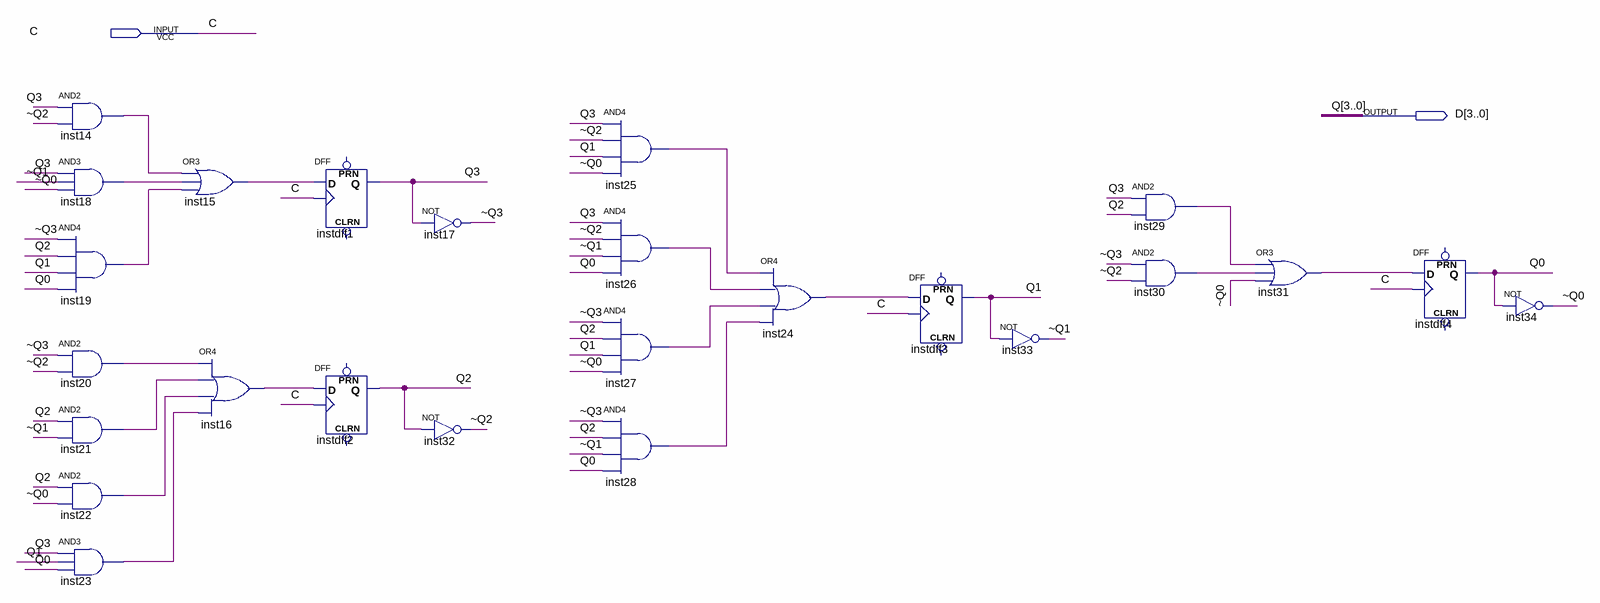
[diagram p0: schematic sheet]
// Quartus schematic Lab7_3.bdf as structural Verilog: 25 symbols, 2 pins
module Lab7_3 (
  input  C,
  output [3:0] D
);

  wire inst14_out, inst15_out, inst16_out, inst18_out, inst19_out, inst20_out, inst21_out, inst22_out,
       inst23_out, inst24_out, inst25_out, inst26_out, inst27_out, inst28_out, inst29_out, inst30_out,
       inst31_out, \~Q0 , \~Q1 , \~Q2 , \~Q3 ;

  and inst14 (inst14_out, D[3], \~Q2 );
  and inst18 (inst18_out, D[3], \~Q1 , \~Q0 );
  and inst19 (inst19_out, \~Q3 , D[2], D[1], D[0]);
  and inst20 (inst20_out, \~Q3 , \~Q2 );
  and inst21 (inst21_out, D[2], \~Q1 );
  and inst22 (inst22_out, D[2], \~Q0 );
  and inst23 (inst23_out, D[3], D[1], D[0]);
  or inst15 (inst15_out, inst14_out, inst18_out, inst19_out);
  or inst16 (inst16_out, inst20_out, inst21_out, inst22_out, inst23_out);
  DFF instdff1 (.CLK(C), .D(inst15_out), .Q(D[3]));  // open: CLRN, PRN
  DFF instdff2 (.CLK(C), .D(inst16_out), .Q(D[2]));  // open: CLRN, PRN
  not inst17 (\~Q3 , D[3]);
  not inst32 (\~Q2 , D[2]);
  and inst25 (inst25_out, D[3], \~Q2 , D[1], \~Q0 );
  and inst26 (inst26_out, D[3], \~Q2 , \~Q1 , D[0]);
  and inst27 (inst27_out, \~Q3 , D[2], D[1], \~Q0 );
  and inst28 (inst28_out, \~Q3 , D[2], \~Q1 , D[0]);
  or inst24 (inst24_out, inst25_out, inst26_out, inst27_out, inst28_out);
  DFF instdff3 (.CLK(C), .D(inst24_out), .Q(D[1]));  // open: CLRN, PRN
  not inst33 (\~Q1 , D[1]);
  and inst29 (inst29_out, D[3], D[2]);
  and inst30 (inst30_out, \~Q3 , \~Q2 );
  or inst31 (inst31_out, inst29_out, inst30_out, \~Q0 );
  DFF instdff4 (.CLK(C), .D(inst31_out), .Q(D[0]));  // open: CLRN, PRN
  not inst34 (\~Q0 , D[0]);

  // Other names for the same wires on the sheet: Q[3:0] = D; Q0 = D[0]; Q1 = D[1]; Q2 = D[2]; Q3 = D[3]
endmodule
